# Altium schematic sheet Э3.SchDoc: Лабораторный
size 420 x 297 mm; Author: Дорунц Ш.А.; DocumentNumber: ИУ4.11.03.03.23.05.52.09.001 Э3; SheetNumber: 1; SheetTotal: 1; Scale: 1:1; Title2str: блок питания; DocumentType: Схема электрическая принципиальная; UniversityName: МГТУ им. Н.Э. Баумана; DepartmentName: Кафедра ИУ4; GroupName: Групаа ИУ4-52Б
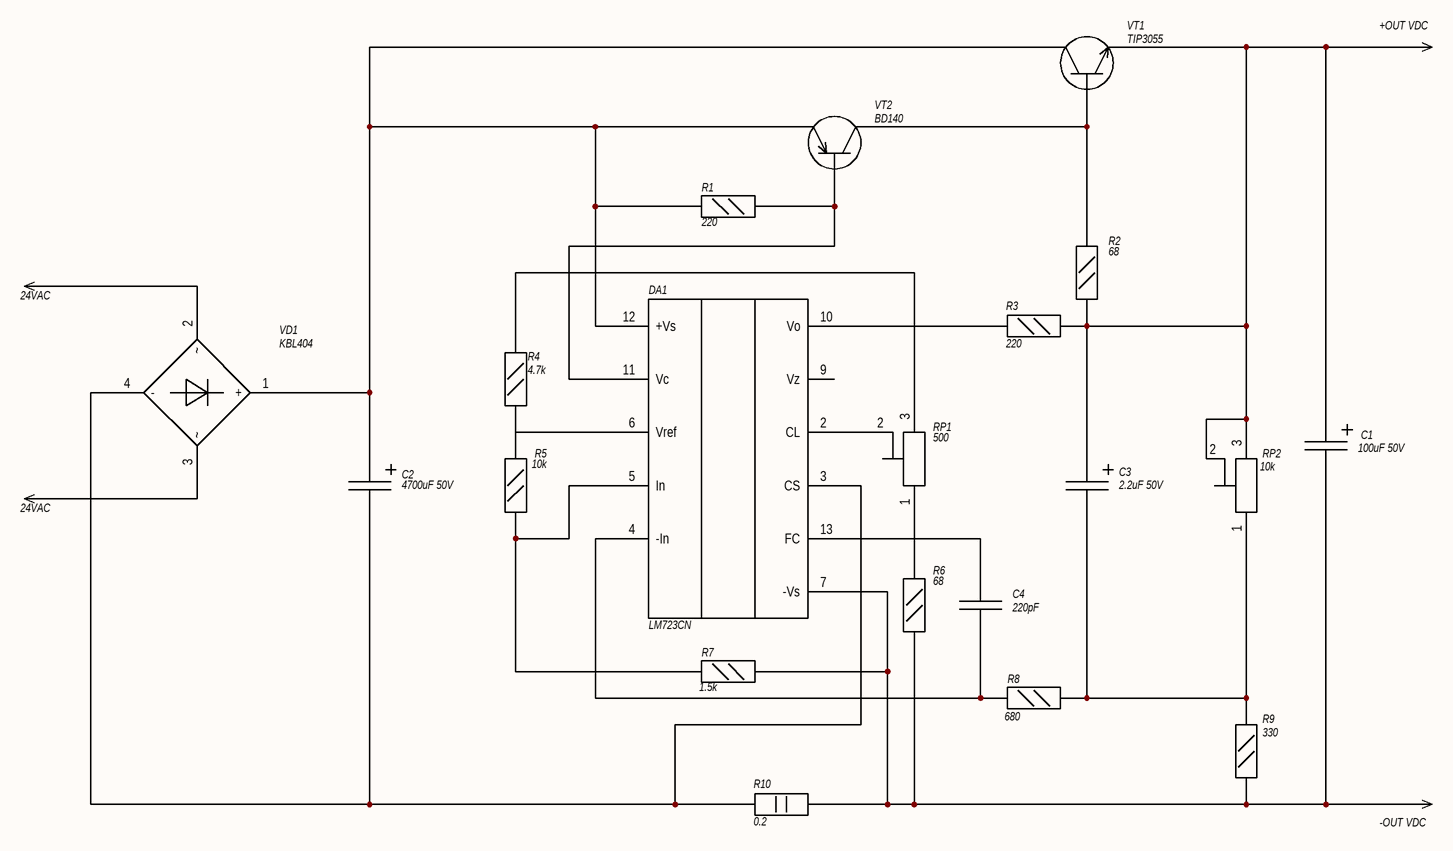
[diagram p0: Э3.SchDoc]

## Parts
C1  100uF 50V  [ECAP 100uF 50V]
C2  4700uF 50V  [ECAP 4700uF 50V]
C3  2.2uF 50V  [ECAP 2.2uF 50V]
C4  220pF  [CAP 220pF]
DA1  LM723CN  [Dip14]
O1  +OUT VDC  [Connection Pad]
O2  24VAC  [Connection Pad]
O3  24VAC  [Connection Pad]
O4  -OUT VDC  [Connection Pad]
R1  220  [Res 0.125W]
R2  68  [Res 0.125W]
R3  220  [Res 0.125W]
R4  4.7k  [Res 0.125W]
R5  10k  [Res 0.125W]
R6  68  [Res 0.125W]
R7  1.5k  [Res 0.125W]
R8  680  [Res 0.125W]
R9  330  [Res 0.125W]
R10  0.2  [Res 2W]
RP1  500  [16K1]
RP2  10k  [16K1]
VD1  KBL404  [KBL]
VT1  TIP3055  [TO-247]
VT2  BD140  [TO-126]

## Nets
NetC1_1: C1.1 C3.1 O1.1 R2.1 R3.1 RP2.2 RP2.3 VT1.3(Э)
NetC1_2: C1.2 DA1.7(-Vs) O4.1 R6.1 R7.1 R9.1 R10.2
NetC2_1: C2.1 DA1.12(+Vs) R1.1 VD1.1(+) VT1.2(К) VT2.2(C)
NetC2_2: C2.2 DA1.3(CS) R10.1 VD1.4(-)
NetC3_2: C3.2 R8.1 R9.2 RP2.1
NetC4_1: C4.1 DA1.4(-In) R8.2
NetC4_2: C4.2 DA1.13(FC)
NetDA1_2: DA1.2(CL) RP1.2
NetDA1_5: DA1.5(In) R5.1 R7.2
NetDA1_6: DA1.6(Vref) R4.1 R5.2
NetDA1_10: DA1.10(Vo) R3.2
NetDA1_11: DA1.11(Vc) R1.2 VT2.1(B)
NetO2_1: O2.1 VD1.2
NetO3_1: O3.1 VD1.3
NetR2_2: R2.2 VT1.1(Б) VT2.3(E)
NetR4_2: R4.2 RP1.3
NetR6_2: R6.2 RP1.1

Not connected (* = marked no-connect by the designer): DA1 9(Vz)

## Notes on the sheet
- Перв. примен.
- Справ. №
- Подп. и дата
- Инв. № дубл.
- Взам. инв. №
- Разраб.
- Изм.
- Лист
- № докум.
- Подп.
- Дата
- Лит.
- Масса
- Масштаб
- Пров.
- Т.контр.
- Листов
- 1
- Инв. № подл.
- Утв.
- Н.контр.
- 2.106-A3
- Копировал
- Формат А3

## Library data of the parts
C1 = ECAP 100uF 50V: Конденсатор электролитический / B41851A6107M000 100мкФ 50В 20% / (EPCOS, Германия)
C2 = ECAP 4700uF 50V: Конденсатор электролитический / B41252C6478M000 4700мкФ 50В 20% / (EPCOS, Германия)
C3 = ECAP 2.2uF 50V: Конденсатор электролитический / TKR2R2M2VE11 2.2мкФ 50В 20% / (Jamicon, США)
C4 = CAP 220pF: Конденсатор керамический / RDE5C1H221J 220пФ 50В 10% / (Murata Electronics, Япония)
DA1 = LM723CN: Регулятор напряжения / LM723CN 2В...37В 150мА / (STMicroelectronics, Франция)
O1-O4 = Connection Pad
R1 R3 = Res 0.125W: Резистор углеродистый / 0.125Вт 220 Ом 5% / (Тайвань)
R2 R6 = Res 0.125W: Резистор углеродистый / 0.125Вт 68 Ом 5% / (Тайвань)
R4 = Res 0.125W: Резистор углеродистый / 0.125Вт 4.7 кОм 5% / (Тайвань)
R5 = Res 0.125W: Резистор углеродистый / 0.125Вт 10 кОм 5% / (Тайвань)
R7 = Res 0.125W: Резистор углеродистый / 0.125Вт 1.5 кОм 5% / (Тайвань)
R8 = Res 0.125W: Резистор углеродистый / 0.125Вт 680 Ом 5% / (Тайвань)
R9 = Res 0.125W: Резистор углеродистый / 0.125Вт  330 Ом 5% / (Тайвань)
R10 = Res 2W: Резистор углеродистый / 2Вт 0.2 Ом 5% / (Тайвань)
RP1 = Potentiometer: Потенциометр / 16K1 0.2Вт 500 Ом 10%
RP2 = Potentiometer: Потенциометр / 16K1 0.2Вт 10 кОм 10%
VD1 = KBL404: Диодный мост / KDL404 4А 400В
VT1 = TIP3055: Транзистор NPN / TIP3055 60В 15А TO-247 / (STMicroelectronics, Франция)
VT2 = BD140: Транзистор PNP / BD140 80В 1.5А TO-126 / (STMicroelectronics, Франция)